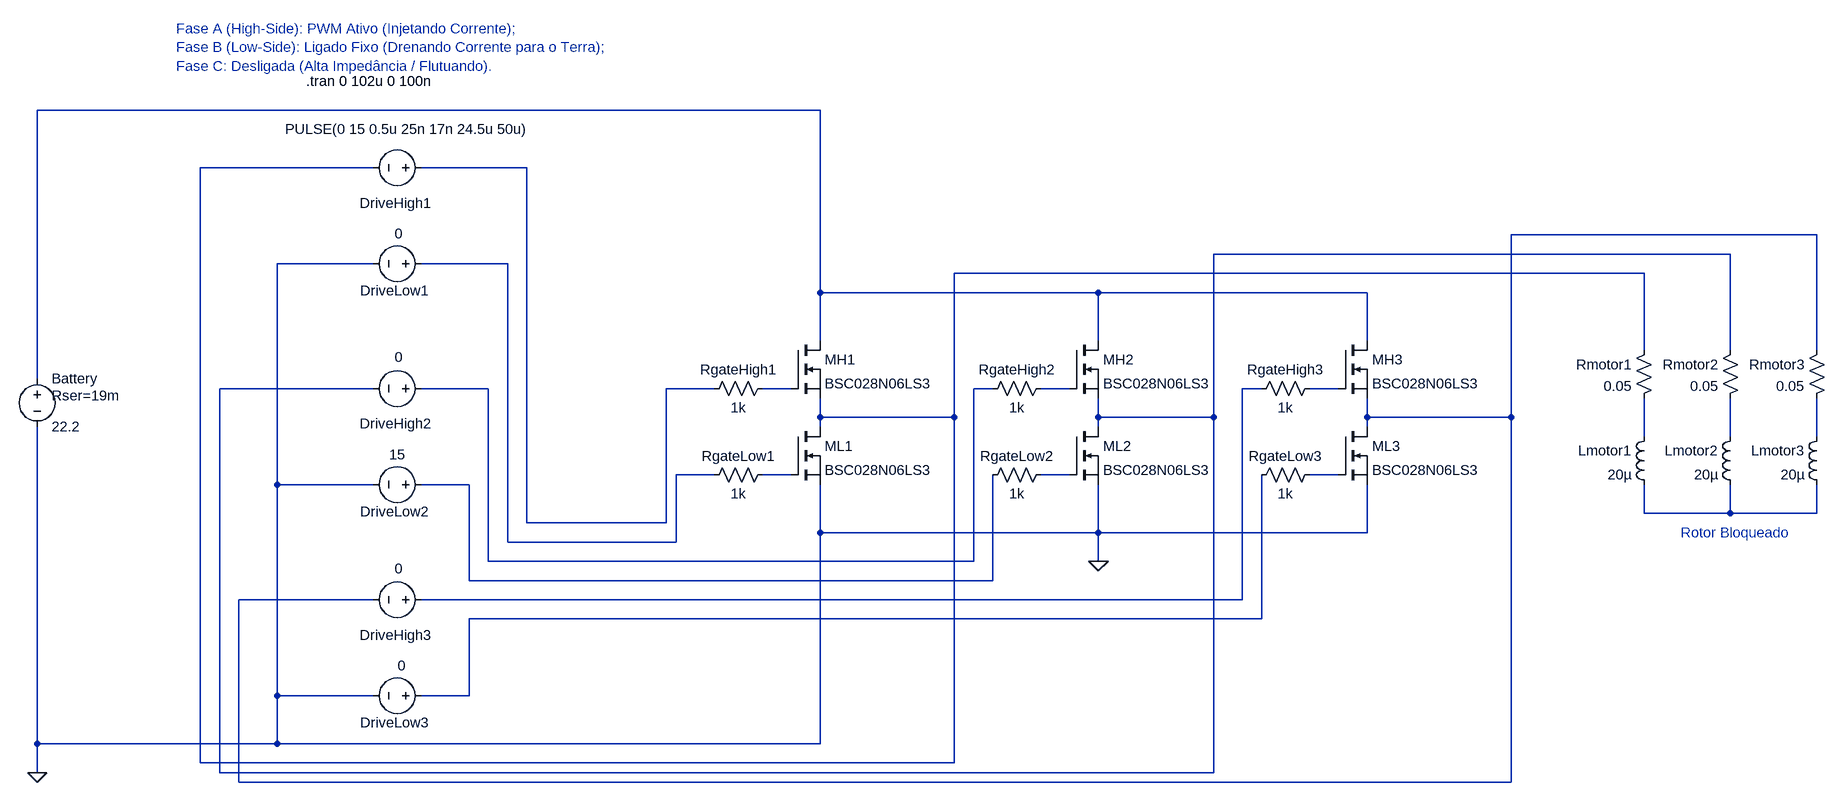
[diagram p0: schematic trifasico.asc]
trifasico.asc, the LTspice schematic file:
Version 4.1
SHEET 1 1412 992
WIRE -448 -528 -1936 -528
WIRE -1376 -432 -1664 -432
WIRE -1120 -432 -1296 -432
WIRE 1360 -320 704 -320
WIRE 1216 -288 208 -288
WIRE -1376 -272 -1536 -272
WIRE -1152 -272 -1296 -272
WIRE 1072 -256 -224 -256
WIRE -448 -224 -448 -528
WIRE 16 -224 -448 -224
WIRE 464 -224 16 -224
WIRE -448 -144 -448 -224
WIRE 16 -144 16 -224
WIRE 464 -144 464 -224
WIRE 1072 -128 1072 -256
WIRE 1216 -128 1216 -288
WIRE 1360 -128 1360 -320
WIRE -1936 -80 -1936 -528
WIRE -1376 -64 -1632 -64
WIRE -1184 -64 -1296 -64
WIRE -624 -64 -704 -64
WIRE -496 -64 -544 -64
WIRE -160 -64 -192 -64
WIRE -32 -64 -80 -64
WIRE 288 -64 256 -64
WIRE 416 -64 368 -64
WIRE -448 -16 -448 -48
WIRE -224 -16 -224 -256
WIRE -224 -16 -448 -16
WIRE 16 -16 16 -48
WIRE 208 -16 208 -288
WIRE 208 -16 16 -16
WIRE 464 -16 464 -48
WIRE 704 -16 704 -320
WIRE 704 -16 464 -16
WIRE -448 0 -448 -16
WIRE 16 0 16 -16
WIRE 464 0 464 -16
WIRE 1072 16 1072 -48
WIRE 1216 16 1216 -48
WIRE 1360 16 1360 -48
WIRE -624 80 -688 80
WIRE -496 80 -544 80
WIRE -32 80 -80 80
WIRE 416 80 368 80
WIRE -1536 96 -1536 -272
WIRE -1376 96 -1536 96
WIRE -1216 96 -1296 96
WIRE 1072 144 1072 96
WIRE 1216 144 1216 96
WIRE 1216 144 1072 144
WIRE 1360 144 1360 96
WIRE 1360 144 1216 144
WIRE -1120 160 -1120 -432
WIRE -704 160 -704 -64
WIRE -704 160 -1120 160
WIRE -448 176 -448 96
WIRE 16 176 16 96
WIRE 16 176 -448 176
WIRE 464 176 464 96
WIRE 464 176 16 176
WIRE -1152 192 -1152 -272
WIRE -688 192 -688 80
WIRE -688 192 -1152 192
WIRE -1184 224 -1184 -64
WIRE -192 224 -192 -64
WIRE -192 224 -1184 224
WIRE 16 224 16 176
WIRE -1216 256 -1216 96
WIRE -160 256 -160 80
WIRE -160 256 -1216 256
WIRE -1376 288 -1600 288
WIRE 256 288 256 -64
WIRE 256 288 -1296 288
WIRE 288 320 288 80
WIRE 288 320 -1216 320
WIRE -1536 448 -1536 96
WIRE -1376 448 -1536 448
WIRE -1216 448 -1216 320
WIRE -1216 448 -1296 448
WIRE -1936 528 -1936 0
WIRE -1536 528 -1536 448
WIRE -1536 528 -1936 528
WIRE -448 528 -448 176
WIRE -448 528 -1536 528
WIRE -1664 560 -1664 -432
WIRE -224 560 -224 -16
WIRE -224 560 -1664 560
WIRE -1936 576 -1936 528
WIRE -1632 576 -1632 -64
WIRE 208 576 208 -16
WIRE 208 576 -1632 576
WIRE -1600 592 -1600 288
WIRE 704 592 704 -16
WIRE 704 592 -1600 592
FLAG 16 224 0
FLAG -1936 576 0
SYMBOL nmos -496 -144 R0
SYMATTR InstName MH1
SYMATTR Value BSC028N06LS3
SYMBOL nmos -496 0 R0
SYMATTR InstName ML1
SYMATTR Value BSC028N06LS3
SYMBOL voltage -1936 -96 R0
WINDOW 123 0 0 Left 0
WINDOW 39 24 44 Left 2
SYMATTR SpiceLine Rser=19m
SYMATTR InstName Battery
SYMATTR Value 22.2
SYMBOL voltage -1280 -272 R90
WINDOW 123 0 0 Left 0
WINDOW 39 0 0 Left 0
WINDOW 0 45 4 VRight 2
WINDOW 3 -50 47 VRight 2
SYMATTR InstName DriveLow1
SYMATTR Value 0
SYMBOL voltage -1280 -432 R90
WINDOW 123 0 0 Left 0
WINDOW 39 0 0 Left 0
WINDOW 0 59 -1 VRight 2
WINDOW 3 -64 -162 VRight 2
SYMATTR InstName DriveHigh1
SYMATTR Value PULSE(0 15 0.5u 25n 17n 24.5u 50u)
SYMBOL res 1376 -144 M0
SYMATTR InstName Rmotor3
SYMATTR Value 0.05
SYMBOL ind 1376 0 M0
SYMATTR InstName Lmotor3
SYMATTR Value 20µ
SYMBOL res -528 -80 R90
WINDOW 0 0 56 VBottom 2
WINDOW 3 32 56 VTop 2
SYMATTR InstName RgateHigh1
SYMATTR Value 1k
SYMATTR SpiceLine tol=1 pwr=0.25
SYMBOL res -528 64 R90
WINDOW 0 0 56 VBottom 2
WINDOW 3 32 56 VTop 2
SYMATTR InstName RgateLow1
SYMATTR Value 1k
SYMATTR SpiceLine tol=1 pwr=0.25
SYMBOL res 1232 -144 M0
SYMATTR InstName Rmotor2
SYMATTR Value 0.05
SYMBOL ind 1232 0 M0
SYMATTR InstName Lmotor2
SYMATTR Value 20µ
SYMBOL res 1088 -144 M0
SYMATTR InstName Rmotor1
SYMATTR Value 0.05
SYMBOL ind 1088 0 M0
SYMATTR InstName Lmotor1
SYMATTR Value 20µ
SYMBOL nmos -32 -144 R0
SYMATTR InstName MH2
SYMATTR Value BSC028N06LS3
SYMBOL nmos -32 0 R0
SYMATTR InstName ML2
SYMATTR Value BSC028N06LS3
SYMBOL res -64 -80 R90
WINDOW 0 0 56 VBottom 2
WINDOW 3 32 56 VTop 2
SYMATTR InstName RgateHigh2
SYMATTR Value 1k
SYMATTR SpiceLine tol=1 pwr=0.25
SYMBOL res -64 64 R90
WINDOW 0 0 56 VBottom 2
WINDOW 3 32 56 VTop 2
SYMATTR InstName RgateLow2
SYMATTR Value 1k
SYMATTR SpiceLine tol=1 pwr=0.25
SYMBOL nmos 416 -144 R0
SYMATTR InstName MH3
SYMATTR Value BSC028N06LS3
SYMBOL nmos 416 0 R0
SYMATTR InstName ML3
SYMATTR Value BSC028N06LS3
SYMBOL res 384 -80 R90
WINDOW 0 0 56 VBottom 2
WINDOW 3 32 56 VTop 2
SYMATTR InstName RgateHigh3
SYMATTR Value 1k
SYMATTR SpiceLine tol=1 pwr=0.25
SYMBOL res 384 64 R90
WINDOW 0 0 56 VBottom 2
WINDOW 3 32 56 VTop 2
SYMATTR InstName RgateLow3
SYMATTR Value 1k
SYMATTR SpiceLine tol=1 pwr=0.25
SYMBOL voltage -1280 96 R90
WINDOW 123 0 0 Left 0
WINDOW 39 0 0 Left 0
WINDOW 0 45 4 VRight 2
WINDOW 3 -50 42 VRight 2
SYMATTR InstName DriveLow2
SYMATTR Value 15
SYMBOL voltage -1280 -64 R90
WINDOW 123 0 0 Left 0
WINDOW 39 0 0 Left 0
WINDOW 0 59 -1 VRight 2
WINDOW 3 -52 47 VRight 2
SYMATTR InstName DriveHigh2
SYMATTR Value 0
SYMBOL voltage -1280 448 R90
WINDOW 123 0 0 Left 0
WINDOW 39 0 0 Left 0
WINDOW 0 45 4 VRight 2
WINDOW 3 -50 42 VRight 2
SYMATTR InstName DriveLow3
SYMATTR Value 0
SYMBOL voltage -1280 288 R90
WINDOW 123 0 0 Left 0
WINDOW 39 0 0 Left 0
WINDOW 0 59 -1 VRight 2
WINDOW 3 -52 47 VRight 2
SYMATTR InstName DriveHigh3
SYMATTR Value 0
TEXT 1224 176 Center 2 ;Rotor Bloqueado
TEXT -1704 -664 Left 2 ;Fase A (High-Side): PWM Ativo (Injetando Corrente);\nFase B (Low-Side): Ligado Fixo (Drenando Corrente para o Terra);\nFase C: Desligada (Alta Impedância / Flutuando).
TEXT -1488 -576 Left 2 !.tran 0 102u 0 100n

The netlist it stands for:
* trifasico.asc
MH1 N001 N008 N002 N002 BSC028N06LS3
ML1 N002 N015 0 0 BSC028N06LS3
V§Battery N001 0 22.2 Rser=19m
V§DriveLow1 N006 0 0
V§DriveHigh1 N003 N002 PULSE(0 15 0.5u 25n 17n 24.5u 50u)
Rmotor3 N004 N014 0.05
Lmotor3 N014 N019 20µ
RgateHigh1 N008 N003 1k tol=1 pwr=0.25
RgateLow1 N015 N006 1k tol=1 pwr=0.25
Rmotor2 N005 N013 0.05
Lmotor2 N013 N019 20µ
Rmotor1 N002 N012 0.05
Lmotor1 N012 N019 20µ
MH2 N001 N009 N005 N005 BSC028N06LS3
ML2 N005 N016 0 0 BSC028N06LS3
RgateHigh2 N009 N007 1k tol=1 pwr=0.25
RgateLow2 N016 N018 1k tol=1 pwr=0.25
MH3 N001 N011 N004 N004 BSC028N06LS3
ML3 N004 N017 0 0 BSC028N06LS3
RgateHigh3 N011 N010 1k tol=1 pwr=0.25
RgateLow3 N017 N020 1k tol=1 pwr=0.25
V§DriveLow2 N018 0 15
V§DriveHigh2 N007 N005 0
V§DriveLow3 N020 0 0
V§DriveHigh3 N010 N004 0
.model NMOS NMOS
.model PMOS PMOS
.lib standard.mos
* Rotor Bloqueado
* Fase A (High-Side): PWM Ativo (Injetando Corrente);
* Fase B (Low-Side): Ligado Fixo (Drenando Corrente para o Terra);
* Fase C: Desligada (Alta Impedância / Flutuando).
.tran 0 102u 0 100n
.backanno
.end